# EAGLE design ch340_usb (EAGLE 9.6.2)
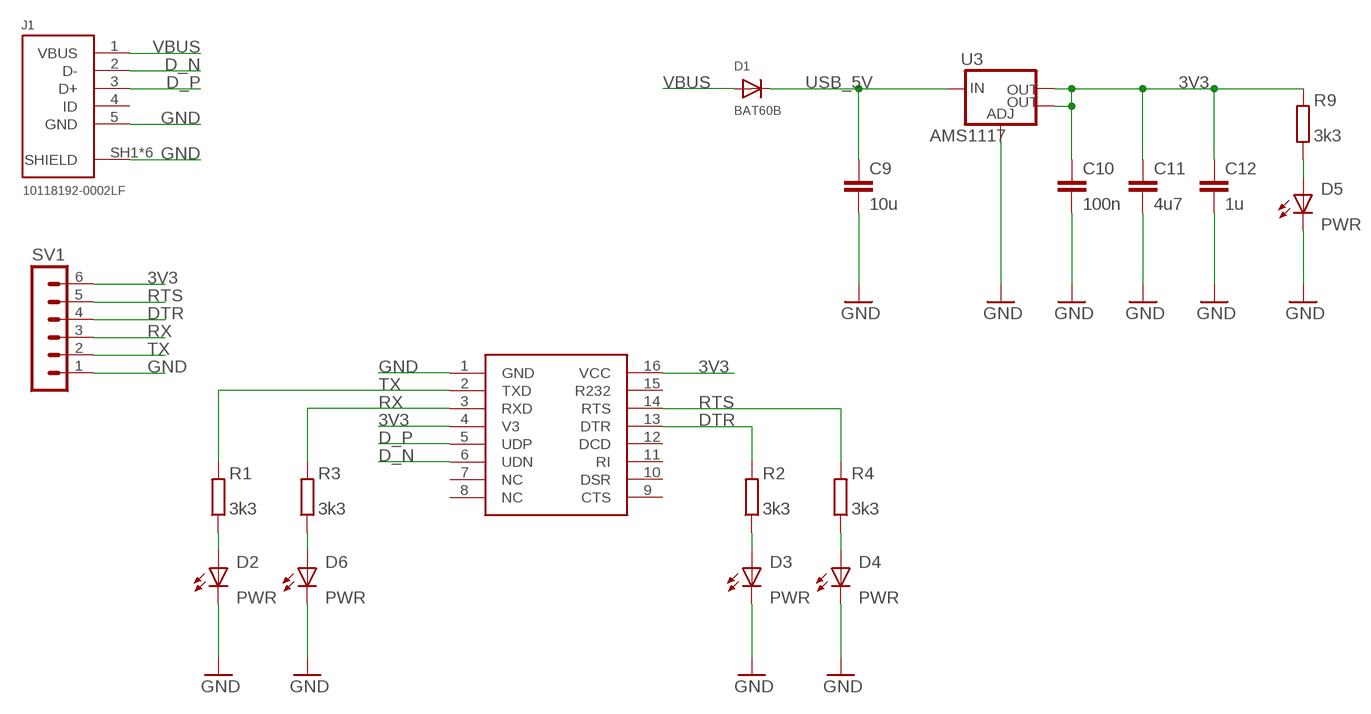
[diagram p0: schematic, sheet 1]

## Parts
C9  10u  C-EUC0603  [C0603]
C10  100n  C-EUC0603  [C0603]
C11  4u7  C-EUC0603  [C0603]
C12  1u  C-EUC0603  [C0603]
D1  BAT60B  DIODESOD-323F  [SOD-323F]
D2  PWR  LEDCHIPLED_0805  [CHIPLED_0805]
D3  PWR  LEDCHIPLED_0805  [CHIPLED_0805]
D4  PWR  LEDCHIPLED_0805  [CHIPLED_0805]
D5  PWR  LEDCHIPLED_0805  [CHIPLED_0805]
D6  PWR  LEDCHIPLED_0805  [CHIPLED_0805]
J1  10118192-0002LF  [10118192-0002LF]
R1  3k3  R-EU_R0603  [R0603]
R2  3k3  R-EU_R0603  [R0603]
R3  3k3  R-EU_R0603  [R0603]
R4  3k3  R-EU_R0603  [R0603]
R9  3k3  R-EU_R0603  [R0603]
SV1  MA06-1  [MA06-1]
U3  AMS1117  V_REG_LM1117SOT223  [SOT223]
U$1  CH340  [SOP16]

## Nets
3V3: C10.1 C11.1 C12.1 R9.2 SV1.6 U3.2(OUT) U3.4(OUT) U$1.4(V3) U$1.16(VCC)
D_N [usb]: J1.2(D-) U$1.6(UDN)
D_P [usb]: J1.3(D+) U$1.5(UDP)
DTR: R2.2 SV1.4 U$1.13(DTR)
GND: C9.2 C10.2 C11.2 C12.2 D2.C D3.C D4.C D5.C D6.C J1.5(GND) J1.SH1(SHIELD) J1.SH2(SHIELD) J1.SH3(SHIELD) J1.SH4(SHIELD) J1.SH5(SHIELD) J1.SH6(SHIELD) SV1.1 U3.1(ADJ) U$1.1(GND)
N$1: D2.A R1.1
N$2: D6.A R3.1
N$9: D3.A R2.1
N$10: D4.A R4.1
N$13: D5.A R9.1
RTS: R4.2 SV1.5 U$1.14(RTS)
RX: R3.2 SV1.3 U$1.3(RXD)
TX: R1.2 SV1.2 U$1.2(TXD)
USB_5V: C9.1 D1.C U3.3(IN)
VBUS: D1.A J1.1(VBUS)
Unconnected: J1.4(ID) U$1.7(NC) U$1.8(NC) U$1.9(CTS) U$1.10(DSR) U$1.11(RI) U$1.12(DCD) U$1.15(R232)

## Library data of the parts
C9-C12 = rcl:C-EU: CAPACITOR, European symbol; SPICEPREFIX: C
D1 = adafruit:DIODE: Diode SMADIODE - SMA Surface Mount Package 20V 1A Schottky Diode Digikey: 641-1014-6-ND DO-1N4148 - Through Hole Small Current Diode SOD-123 20V 1 A (.5mV Vf) Schottky Diode - Digikey: MBRX120TPMSCT-ND SOD-323 10V 570mA (.38mV Vf, 3ns) Schottky Diode - Digikey: ZLLS410CT-ND SOD-523 30V 30mA Schottky Diode (RB751S-40TE61) - Digikey: RB751S-40TE61CT-ND SOT23-R/W - SOT23 Package (R = Solder Paste/Reflow Ovens, W = Hand-Soldering) BAT54Film 40V 300mA - Digikey: 497-7162-1-ND
D2-D6 = adafruit:LED: LED OSRAM: - CHIPLED LG R971, LG N971, LY N971, LG Q971, LY Q971, LO R971, LY R971 LH N974, LH R974 LS Q976, LO Q976, LY Q976 LO Q996 - Hyper CHIPLED LW Q18S LB Q993, LB Q99A, LB R99A - SideLED LS A670, LO A670, LY A670, LG A670, LP A670 LB A673, LV A673, LT A673, LW A673 LH A674 LY A675 LS A676, LA A676, LO A676, LY A676, LW A676 LS A679, LY A679, LG A679 - Hyper Micro SIDELED® LS Y876, LA Y876, LO Y876, LY Y876 LT Y87S - SmartLED LW L88C, LW L88S LB L89C, LB L89S, LG L890 LS L89K, LO L89K, LY L89K LS L896, LA L896, LO L896, LY L896 - TOPLED LS T670, LO T670, LY T670, LG T670, LP T670 LSG T670, LSP T670, LSY T670, LOP T670, LYG T670 LG T671, LOG T671, LSG T671 LB T673, LV T673, LT T673, LW T673 LH T674 LS T676, LA T676, LO T676, LY T676, LB T676, LH T676, LSB T676, LW T676 LB T67C, LV T67C, LT T67C, LS T67K, LO T67K, LY T67K, LW E67C LS E67B, LA E67B, LO E67B, LY E67B, LB E67C, LV E67C, LT E67C LW T67C LS T679, LY T679, LG T679 LS T770, LO T770, LY T770, LG T770, LP T770 LB T773, LV T773, LT T773, LW T773 LH T774 LS E675, LA E675, LY E675, LS T675 LS T776, LA T776, LO T776, LY T776, LB T776 LHGB T686 LT T68C, LB T68C - Hyper Mini TOPLED® LB M676 - Mini TOPLED Santana® LG M470 LS M47K, LO M47K, LY M47K Source: http://www.osram.convergy.de/
J1 = USB connector:10118192-0002LF: CONN RCPT USB2.0 MICRO B SMD R/A Manufacturer's datasheet <https://www.amphenol-icc.com/media/wysiwyg/files/drawing/10118192.pdf>; CREATED_BY: PCBLayout.com; DIGIKEY_PARTNO: 609-5379-2-ND; MANUFACTURER: Amphenol ICC (FCI); MPN: 10118192-0002LF
R1-R4 R9 = rcl:R-EU_: RESISTOR, European symbol; SPICEPREFIX: R
SV1 = con-lstb:MA06-1: PIN HEADER; OC_FARNELL: unknown; OC_NEWARK: unknown
U3 = SparkFun-IC-Power:V_REG_LM1117: Voltage Regulator LM1117 Standard adjustable voltage regulator but in SMD form. Spark Fun Electronics SKU : COM-00595; PROD_ID: VREG-08170
U$1 = ch340:CH340

## Net classes
1 usb: width 0.254 mm, clearance 0.203 mm

## Board
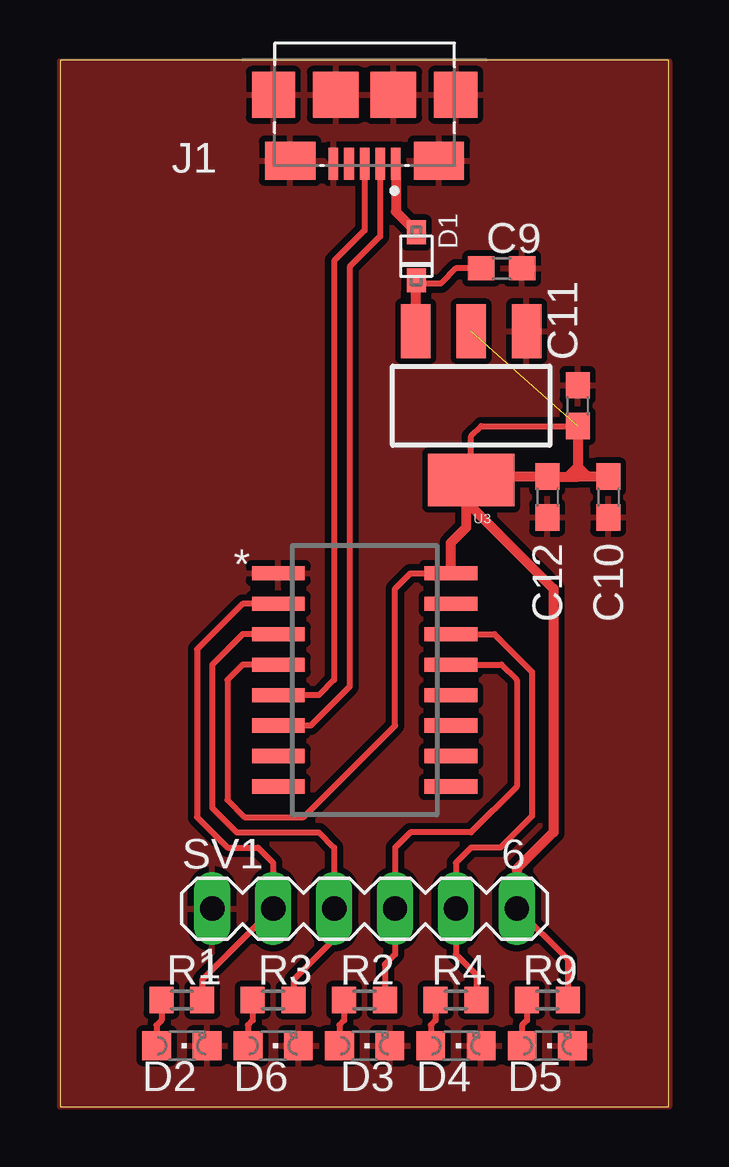
[diagram p1: board, top side]

Size 25.38 x 43.61 mm. Coordinates in mm from the lower left corner, seen from the top.
Outline: 0,0 25.38,0 25.38,43.61 0,43.61 0,0
Copper layers (1*16): Top 0.035mm / dielectric 1.5mm / Bottom 0.035mm
Design rules "default *": minimum track width 6mil, minimum drill 0.35mm, track to track 6mil, track to pad 6mil, pad to pad 6mil, via to via 6mil, smd to smd 6mil, copper to edge 0mil, drill to drill 6mil, minimum pad ring 10mil, minimum via ring 8mil, stop-mask expansion 4mil, vias tented up to drill 0mil, thermal gap 10mil

### Footprints (pad centres in the part's own frame; a part is rotated, then mirrored left to right if it is on the bottom)
C0603 = smd 1.1 x 1: 1 -0.85,0; 2 0.85,0
SOD-323F = smd 1 x 0.8: A -1,0; C 1,0
CHIPLED_0805 = smd 1.2 x 1.2: A 0,-1.05; C 0,1.05
10118192-0002LF = smd 0.4 x 1.35: 1 -1.3,2.875; 2 -0.65,2.875; 3 0,2.875; 4 0.65,2.875; 5 1.3,2.875 | smd 2.1 x 1.6: SH1 -3.1,2.75; SH2 3.1,2.75 | smd 1.8 x 1.9: SH3 -3.8,0; SH4 3.8,0 | smd 1.9 x 1.9: SH5 -1.2,0; SH6 1.2,0
R0603 = smd 1 x 1.1: 1 -0.85,0; 2 0.85,0
MA06-1 = drill 1.016 long: 1 -6.35,0; 2 -3.81,0; 3 -1.27,0; 4 1.27,0; 5 3.81,0; 6 6.35,0
SOT223 = smd 1.219 x 2.235: 1 -2.311,-3.099; 2 0,-3.099; 3 2.311,-3.099 | smd 3.6 x 2.2: 4 0,3.099
SOP16 = smd 2.2 x 0.6: 1 -3.6,4.445; 2 -3.6,3.175; 3 -3.6,1.905; 4 -3.6,0.635; 5 -3.6,-0.635; 6 -3.6,-1.905; 7 -3.6,-3.175; 8 -3.6,-4.445; 9 3.6,-4.445; 10 3.6,-3.175; 11 3.6,-1.905; 12 3.6,-0.635; 13 3.6,0.635; 14 3.6,1.905; 15 3.6,3.175; 16 3.6,4.445

### Placement (x,y rotation side)
C9  18.41,34.92 0 top
C10  22.86,25.4 270 top
C11  21.59,29.21 90 top
C12  20.32,25.4 270 top
D1  14.86,35.43 270 top
D2  5.08,2.54 270 top
D3  12.7,2.54 270 top
D4  16.51,2.54 270 top
D5  20.32,2.54 270 top
D6  8.89,2.54 270 top
J1  12.7,42.16 180 top
R1  5.08,4.45 0 top
R2  12.7,4.45 0 top
R3  8.89,4.45 0 top
R4  16.51,4.45 0 top
R9  20.32,4.45 0 top
SV1  12.7,8.26 0 top
U3  17.14,29.21 180 top
U$1  12.7,17.78 0 top

### Tracks (layer width: path | path; a pad name or v marks a point on that pad's centre or on a via)
3V3  (1 unrouted)
  Top 0.254: U$1.4 7.62,18.41 6.99,17.78 6.99,12.78 7.7,12.06 10.16,12.06 13.97,15.88 13.97,21.59 14.61,22.23 U$1.16 | U3.4 17.14,27.94 17.57,28.36 C11.1 | R9.2 21.17,6.13 SV1.6
  Top 0.406: U3.4 16.93,25.9 16.93,24.13 16.3,23.5 U$1.16 | U3.4 17.18,26.07 17.36,26.25 C12.1 21.17,26.25 | C10.1 22.01,26.25 | 22.01,26.25 21.59,26.25 | 21.17,26.25 21.59,26.25 | C11.1 21.59,26.67 | 21.59,26.25 21.59,26.67 | 21.59,26.67 22.01,26.25 | 21.17,26.25 21.59,26.67 | U3.4 17.14,25.02 20.57,21.59 20.57,11.43 19.05,9.91 SV1.6
D_N
  Top 0.254: U$1.6 10.45,15.88 12.08,17.5 12.08,34.99 13.35,36.26 J1.2
D_P
  Top 0.254: U$1.5 10.79,17.14 11.43,17.78 11.43,35.24 12.7,36.52 J1.3
DTR
  Top 0.254: U$1.13 18.41,18.41 19.05,17.78 19.05,13.34 17.14,11.43 14.61,11.43 13.97,10.79 SV1.4 13.97,6.35 13.55,5.93 R2.2
GND
  pour Top (isolate 0.254): 0,0 0,43.56 25.4,43.56 25.4,0
N$1
  Top 0.254: R1.1 4.23,3.6 4.03,3.4 D2.A
N$2
  Top 0.254: R3.1 8.04,3.6 7.84,3.4 D6.A
N$9
  Top 0.254: R2.1 11.85,3.6 11.65,3.4 D3.A
N$10
  Top 0.254: R4.1 15.66,3.6 15.46,3.4 D4.A
N$13
  Top 0.254: R9.1 19.47,3.6 19.27,3.4 D5.A
RTS
  Top 0.254: U$1.14 18.12,19.68 19.68,18.12 19.68,12.11 18.37,10.79 17.14,10.79 16.51,10.16 SV1.5 16.51,6.35 17.36,5.5 R4.2
RX
  Top 0.254: U$1.3 7.62,19.68 6.35,18.41 6.35,12.45 7.37,11.43 10.79,11.43 11.43,10.79 SV1.3 11.43,6.99 9.74,5.29 R3.2
TX
  Top 0.254: U$1.2 7.62,20.95 5.71,19.05 5.71,12.06 6.99,10.79 8.26,10.79 8.89,10.16 SV1.2 5.93,5.29 R1.2
USB_5V
  Top 0.254: C9.1 16.51,34.92 15.88,34.29 14.83,34.29
  Top 0.406: U3.3 14.83,34.29 14.83,34.41 D1.C
VBUS
  Top 0.406: J1.1 14,37.29 D1.A